# EAGLE design LB_BIT_i5_SLIDEDIMMER-v03(3_3) (EAGLE 6.6.0)
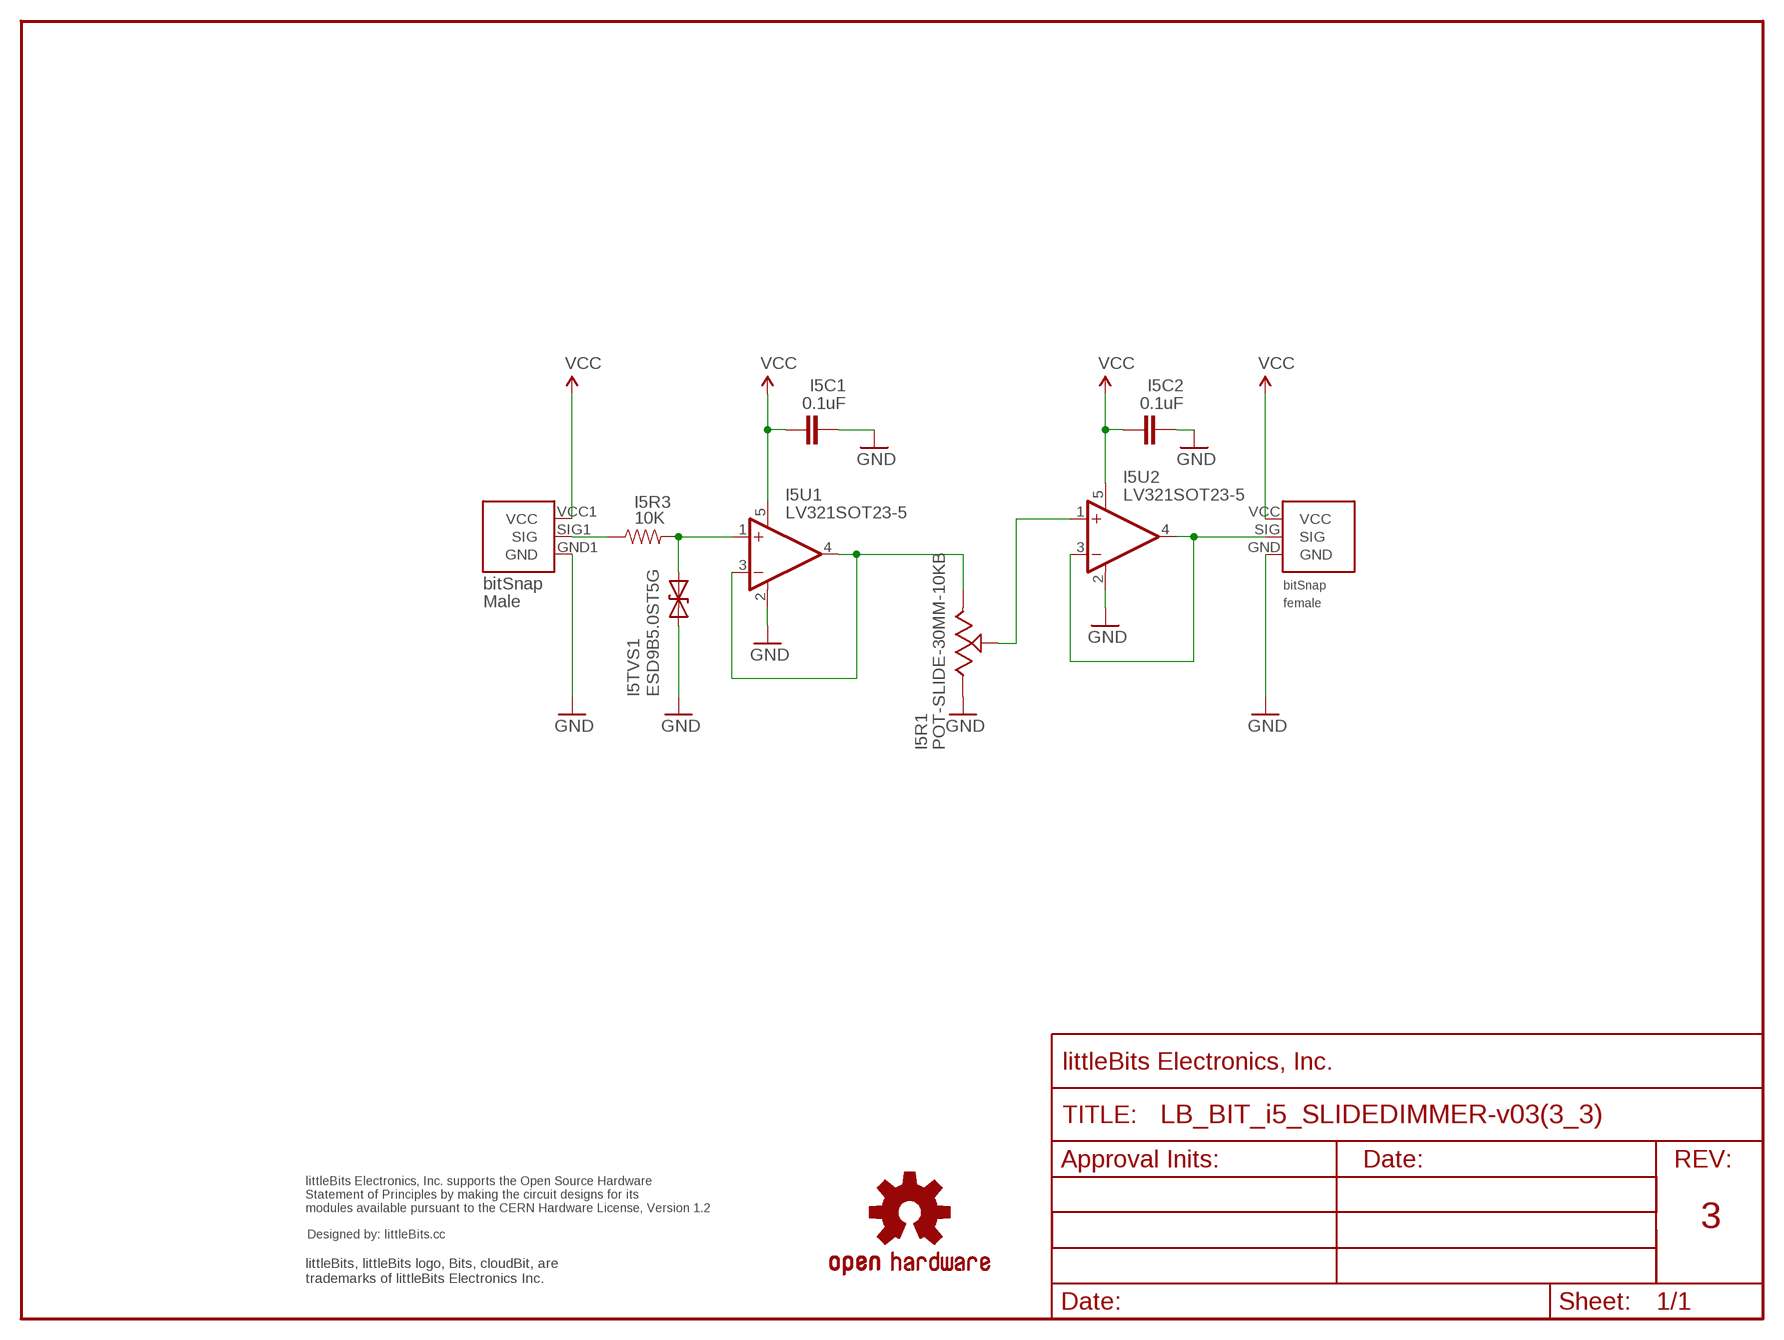
[diagram p0: schematic, sheet 1]

## Parts
FRAME2  FRAME-LETTER-OHWOHW  [FABDWG01-OHW]
I5BSF1  BITSNAP_V03_FEMALE  [BITSNAP_V03_FEMALE]
I5BSM1  BITSNAP_V03_MALE  [BITSNAP_V03_MALE]
I5C1  0.1uF  CAPCAP-0603  [CAP-0603]
I5C2  0.1uF  CAPCAP-0603  [CAP-0603]
I5R1  POT-SLIDE-30MM-10KB  POT-SLIDE-30MM  [POT-SLIDE-30MM]
I5R3  10K  RES-0603  [RES-0603]
I5TVS1  ESD9B5.0ST5G  DIODE-TVSSOD-923  [SOD-923]
I5U1  LV321SOT23-5  [SOT23-5]
I5U2  LV321SOT23-5  [SOT23-5]
U$1  OSHWCREDIT  [OSHWCREDIT]
U$5  OSHW-LOGOL  [OSHW-LOGO-L]

## Nets
GND: I5BSF1.GND I5BSM1.GND1(GND) I5C1.2 I5C2.2 I5R1.3 I5TVS1.1(A) I5U1.2(V-) I5U2.2(V-)
N$1: I5R1.1 I5U1.3(-IN) I5U1.4(OUT)
N$2: I5BSM1.SIG1(SIG) I5R3.1
N$3: I5R3.2 I5TVS1.2(C) I5U1.1(+IN)
N$5: I5R1.2 I5U2.1(+IN)
N$6: I5BSF1.SIG I5U2.3(-IN) I5U2.4(OUT)
VCC: I5BSF1.VCC I5BSM1.VCC1(VCC) I5C1.1 I5C2.1 I5U1.5(V+) I5U2.5(V+)

## Notes on the sheet
- 3

## Library data of the parts
FRAME2 = LITTLEBITS:FRAME-LETTER-OHW
I5BSF1 = bitSnap:BITSNAP_V03_FEMALE
I5BSM1 = bitSnap:BITSNAP_V03_MALE
I5C1 I5C2 = LITTLEBITS:CAP
I5R1 = LITTLEBITS:POT-SLIDE-30MM: Pot-Slide-30mm TT Elect. PS30-10PB10BR10K
I5R3 = LITTLEBITS:RES-0603: Resistor
I5TVS1 = LITTLEBITS:DIODE-TVS: Bidirectional Transient Voltage Suppression Diode: Device conducts in avalanche mode after reaching a part dependent voltage threshold. Used for limiting voltage spikes on ESD sensitive inputs and outputs.; IEC_ESD_PROT0: +/-18kV; LB_PN: ?; MPN: ESD9B5.0ST5G; V_CLAMP: ?; V_OPERATION: 5V
I5U1 I5U2 = LITTLEBITS:LV321
U$1 = LITTLEBITS:OSHWCREDIT
U$5 = SparkFun_NEW:OSHW-LOGO: Open Source Hardware Logo This logo indicates the piece of hardware it is found on incorporates a OSHW license and/or adheres to the definition of open source hardware found here: http://freedomdefined.org/OSHW

## Board
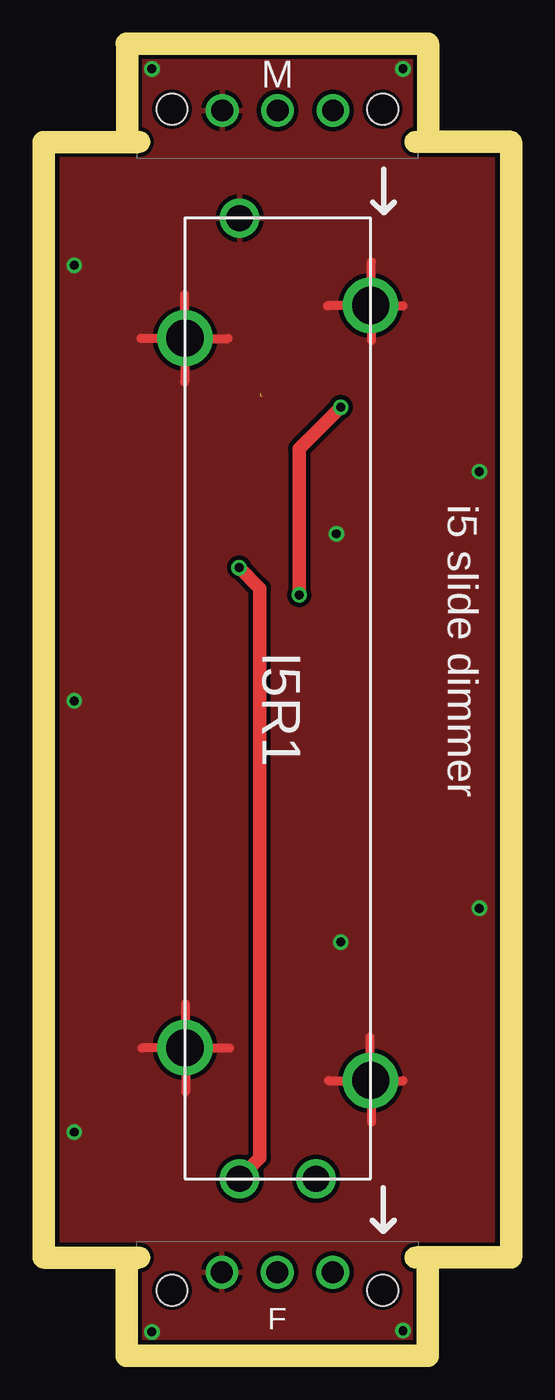
[diagram p1: board, top side]
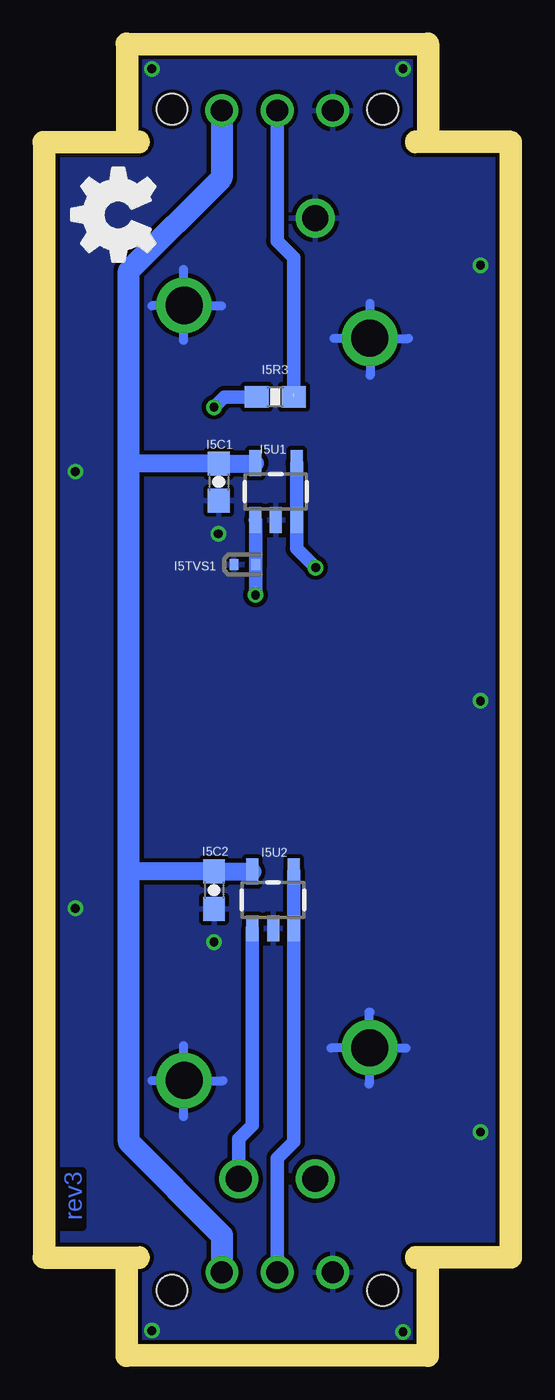
[diagram p2: board, bottom side, seen from below]

Size 20.4 x 59.1 mm. Coordinates in mm from the lower left corner, seen from the top.
Outline: 0,4.5 0,54.6
Outline: 20.4,54.6 20.4,4.5
Copper layers (1*16): Top 0.035mm / dielectric 1.5mm / Bottom 0.035mm
Design rules "default": minimum track width 0.2mm, minimum drill 0.4mm, track to track 0.2mm, track to pad 0.2mm, pad to pad 0.2mm, via to via 0.2mm, smd to smd 0mil, copper to edge 0.2mm, drill to drill 0.2mm, minimum pad ring 0.2mm, minimum via ring 0.15mm, stop-mask expansion 0.1mm, vias tented up to drill 0mil, thermal gap 0.2mm
Milling: 2 lines

### Footprints (pad centres in the part's own frame; a part is rotated, then mirrored left to right if it is on the bottom)
BITSNAP_V03_FEMALE = drill 1: GND 3.91,3.33; SIG 6.45,3.33; VCC 8.99,3.33 | hole 1.4: 1.63,2.5; 11.27,2.5
BITSNAP_V03_MALE = drill 1: GND1 8.98,2.56; SIG1 6.44,2.56; VCC1 3.9,2.56 | hole 1.4: 11.27,2.5; 1.63,2.5
CAP-0603 = smd 1.1 x 1: 1 -0.85,0; 2 0.85,0
POT-SLIDE-30MM = drill 1.2: 1 0,6; 2 0,2.5; 3 44,6 | drill 1.7: P$4 6,8.5; P$5 4.5,0; P$6 40,0; P$7 38.5,8.5
RES-0603 = smd 1.1 x 1: 1 -0.85,0; 2 0.85,0
SOD-923 = smd 0.4 x 0.5: 1 -0.5,0; 2 0.5,0
SOT23-5 = smd 0.55 x 1.2: 1 -0.95,-1.3; 2 0,-1.3; 3 0.95,-1.3; 4 0.95,1.3; 5 -0.95,1.3

### Placement (x,y rotation side)
FRAME2  -7.3,18.9 0 top  (outside the outline)
I5BSF1  3.75,0 0 top
I5BSM1  16.65,59.1 180 top
I5C1  12.89,39.52 270 bottom
I5C2  13.1,20.83 270 bottom
I5R1  14.47,7.61 90 top
I5R3  10.29,43.42 180 bottom
I5TVS1  11.69,35.74 0 bottom
I5U1  10.27,39.09 0 bottom
I5U2  10.4,20.38 0 bottom
U$1  -99.3,-47 0 top  (outside the outline)
U$5  -35.02,-51.68 0 top  (outside the outline)
U$7  [OSHW_FILLX150_NOTEXT]  15.81,48.81 0 top

### Tracks (layer width: path | path; a pad name or v marks a point on that pad's centre or on a via)
GND  (via drill 0.41)
  Top 0.406: 5.95,46.1 5.95,48.1 | 5.95,46.1 3.95,46.1 | 5.95,46.1 5.95,44.1 | 5.95,46.1 7.95,46.1 | 14.5,47.6 12.5,47.6 | 14.5,47.6 14.5,49.6 | 6,13.6 8,13.6 | 6,13.6 6,15.6 | 6,13.6 4,13.6 | 6,13.6 6,11.6 | 14.45,12.1 14.45,14.1 | 14.5,12.2 14.5,10.2 | 12.55,12.1 15.95,12.1 | 14.5,47.6 14.5,46 | 14.5,47.6 15.95,47.6
  Bottom 0.406: 14.5,13.7 14.5,12.1 | 14.5,12.1 14.5,10.45 | 14.5,12.1 12.7,12.1 | 14.5,12.1 15.95,12.1 | 6,13.6 7.75,13.6 | 6,13.6 4.3,13.6 | 6,13.6 6,11.95 | 6,13.65 6,15.25 5.95,15.25 | 14.5,49.25 14.5,47.6 | 14.5,47.6 12.75,47.6 | 14.5,47.6 14.5,46 | 14.5,47.6 15.95,47.6 | 5.95,46.1 5.95,44.4 | 5.95,46.1 4.2,46.1 | 5.95,46.1 5.95,47.7 | 5.95,46.1 7.6,46.1
  other vias: 13.1,18.45 12.9,37.15 19.45,40 0.9,9.75 0.9,49.45 0.9,29.5 4.45,58.45 15.95,58.45 15.95,0.65 4.45,0.6 19.45,20
  pour Top: 0.32,59 20.05,59 20.05,0.32 0.32,0.32
  pour Bottom: 0.32,59 20.05,59 20.05,0.32 0.32,0.32
N$1  (via drill 0.41)
  Top 0.406: 8.45,7.63 8.47,7.63 I5R1.1
  Top 0.61: 8.45,7.63 9.4,8.58 9.4,34.65 v8.45,35.6
  Bottom 0.61: I5U1.4 I5U1.3 9.32,36.47 v8.45,35.6
N$2  (1 unrouted)
  Bottom 0.61: I5BSM1.SIG1 10.21,50.56 9.45,49.8 9.45,43.58 | 9.46,43.44 I5R3.1
N$3  (via drill 0.41)
  Top 0.61: v13.1,42.95 11.2,41.05 v11.2,34.35
  Bottom 0.61: I5R3.2 12.63,43.42 v13.1,42.95 | v11.2,34.35 v11.19,34.36 I5TVS1.2 11.19,37.76 I5U1.1
N$5
  Bottom 0.61: I5R1.2 11.97,9.43 11.35,10.05 I5U2.1
N$6
  Bottom 0.61: I5U2.4 I5U2.3 9.45,9.3 10.2,8.55 I5BSF1.SIG
VCC
  Bottom 0.813: 17,21.65 16.67,21.68 I5C2.1 I5U2.5 | I5U2.5 | I5U1.5 11.24,40.37 I5C1.1 16.57,40.37 17,40.5
  Bottom 1: I5BSM1.VCC1 12.75,53.45 17,49.2 17,40.5 17,21.65 17,9.29 12.74,5.03 I5BSF1.VCC

### Text on the board
Bottom: rev3
tPlace: i5 slide dimmer
tNames: I5R1
Reference: XXL